# Altium schematic sheet OverCurrent_Protection.SchDoc
size A4; SheetNumber: 8; SheetTotal: 21
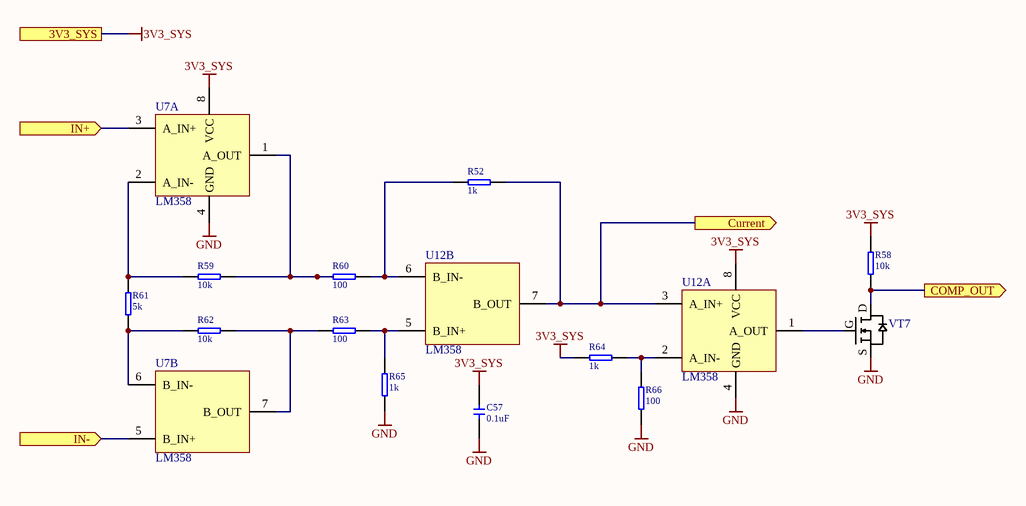
[diagram p0: OverCurrent_Protection.SchDoc]

## Parts
C57  value 0.1uF  [CERCAP 0402]
R52  value 1k  [RES 0402]
R58  value 10k  [RES 0402]
R59  value 10k  [RES 0402]
R60  value 100  [RES 0402]
R61  value 5k  [RES 0402]
R62  value 10k  [RES 0402]
R63  value 100  [RES 0402]
R64  value 1k  [RES 0402]
R65  value 1k  [RES 0402]
R66  value 100  [RES 0402]
U7  LM358  [DFN-8-2x2]  (parts A,B of 2)
U12  LM358  [DFN-8-2x2]  (parts A,B of 2)
VT7  2N7002  [SOT23-3]  (value not drawn)

## Ports
3V3_SYS, COMP_OUT (out), Current (out), IN+ (in), IN- (in)

## Nets
3V3_SYS: C57.2 R58.2 R64.2 U7.8(VCC) U12.8(VCC) ; port 3V3_SYS
GND: C57.1 R65.1 R66.2 U7.4(GND) U12.4(GND) VT7.S1
COMP_OUT: R58.1 VT7.D6 ; port COMP_OUT
Current: R52.1 U12.3(A_IN+) U12.7(B_OUT) ; port Current
IN+: U7.3(A_IN+) ; port IN+
IN-: U7.5(B_IN+) ; port IN-
NetR52_2: R52.2 R60.2 U12.6(B_IN-)
NetR59_1: R59.1 R61.2 U7.2(A_IN-)
NetR59_2: R59.2 R60.1 U7.1(A_OUT)
NetR61_1: R61.1 R62.1 U7.6(B_IN-)
NetR62_2: R62.2 R63.1 U7.7(B_OUT)
NetR63_2: R63.2 R65.2 U12.5(B_IN+)
NetR64_1: R64.1 R66.1 U12.2(A_IN-)
NetU12_1: U12.1(A_OUT) VT7.G2

## Notes on the sheet
- (in symbol !Generic N MOSFET) D; G; S

## Library data of the parts
C57 = !Capacitor: Capacitor; IsSMT: NoSMT; Voltage: 50V; Diel: X7R
R52 R58-R66 = !Resistor: Resistor; IsSMT: NoSMT
U7 U12 = DualOpAmp: Operational amplifier
VT7 = !Generic N MOSFET: generic N mosfet; pin to pad: D6>3 G2>1 S1>2; IsSMT: NoSMT